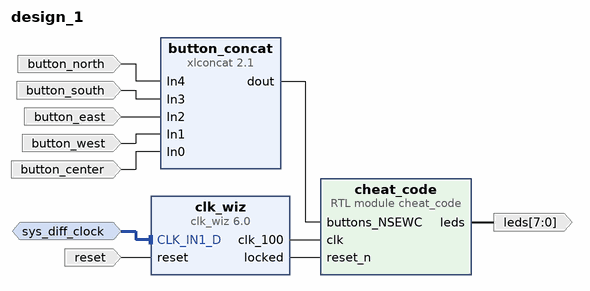
[diagram p0: block diagram of the top level]
# Vivado block design design_1, xc7k325tffg900-2, Vivado 2020.1
create_bd_design design_1

create_bd_intf_port -mode Slave -vlnv xilinx.com:interface:diff_clock_rtl:1.0 sys_diff_clock
set_property -dict {CONFIG.FREQ_HZ 200000000} [get_bd_intf_ports sys_diff_clock]
create_bd_port -dir I reset
create_bd_port -dir I -type data button_north
create_bd_port -dir I -type data button_south
create_bd_port -dir I -type data button_east
create_bd_port -dir I -type data button_west
create_bd_port -dir I -type data button_center
create_bd_port -dir O -from 7 -to 0 -type data leds

create_bd_cell -type ip -vlnv xilinx.com:ip:clk_wiz:6.0 clk_wiz
set_property -dict [list \
  CONFIG.CLK_IN1_BOARD_INTERFACE sys_diff_clock \
  CONFIG.CLK_OUT1_PORT clk_100 \
  CONFIG.USE_BOARD_FLOW true \
] [get_bd_cells clk_wiz]
create_bd_cell -type ip -vlnv xilinx.com:ip:xlconcat:2.1 button_concat
set_property -dict {CONFIG.NUM_PORTS 5} [get_bd_cells button_concat]
create_bd_cell -type module -reference cheat_code cheat_code

# ---- connections ----

connect_bd_intf_net [get_bd_intf_ports sys_diff_clock] [get_bd_intf_pins clk_wiz/CLK_IN1_D]
connect_bd_net [get_bd_ports reset] [get_bd_pins clk_wiz/reset]
connect_bd_net [get_bd_pins clk_wiz/clk_100] [get_bd_pins cheat_code/clk]
connect_bd_net [get_bd_pins button_concat/dout] [get_bd_pins cheat_code/buttons_NSEWC]
connect_bd_net [get_bd_pins cheat_code/leds] [get_bd_ports leds]
connect_bd_net [get_bd_pins clk_wiz/locked] [get_bd_pins cheat_code/reset_n]
connect_bd_net [get_bd_ports button_north] [get_bd_pins button_concat/In4]
connect_bd_net [get_bd_ports button_south] [get_bd_pins button_concat/In3]
connect_bd_net [get_bd_ports button_east] [get_bd_pins button_concat/In2]
connect_bd_net [get_bd_ports button_west] [get_bd_pins button_concat/In1]
connect_bd_net [get_bd_ports button_center] [get_bd_pins button_concat/In0]

validate_bd_design
save_bd_design
